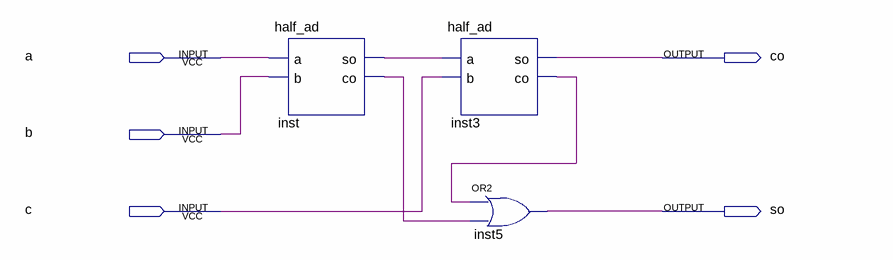
[diagram p0: schematic sheet]
// Quartus schematic adder.bdf as structural Verilog: 3 symbols, 5 pins
module adder (
  input  a,
  input  b,
  input  c,
  output co,
  output so
);

  wire inst3_co, inst_co, inst_so;

  half_ad inst (.a(a), .b(b), .so(inst_so), .co(inst_co));
  half_ad inst3 (.a(inst_so), .b(c), .so(co), .co(inst3_co));
  or inst5 (so, inst3_co, inst_co);
endmodule
